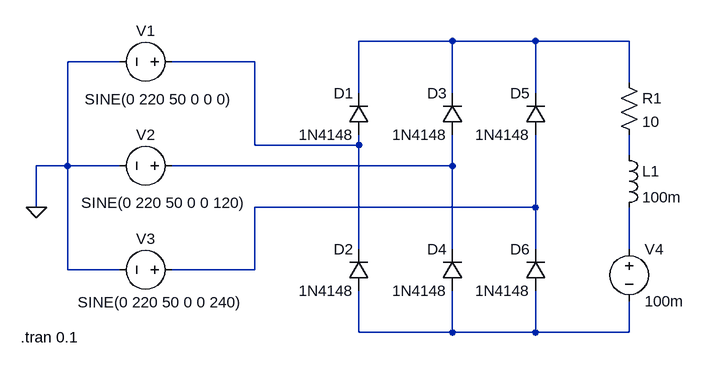
[diagram p0: schematic 3 Phase FWR-RLE.asc]
3 Phase FWR-RLE.asc, the LTspice schematic file:
Version 4
SHEET 1 880 680
WIRE 464 -208 320 -208
WIRE 592 -208 464 -208
WIRE 736 -208 592 -208
WIRE -48 -176 -128 -176
WIRE 160 -176 32 -176
WIRE 736 -144 736 -208
WIRE 320 -128 320 -208
WIRE 464 -128 464 -208
WIRE 592 -128 592 -208
WIRE 160 -48 160 -176
WIRE 320 -48 320 -64
WIRE 320 -48 160 -48
WIRE 736 -32 736 -64
WIRE -128 -16 -128 -176
WIRE -128 -16 -176 -16
WIRE -48 -16 -128 -16
WIRE 464 -16 464 -64
WIRE 464 -16 32 -16
WIRE -176 48 -176 -16
WIRE 592 48 592 -64
WIRE 592 48 160 48
WIRE 320 112 320 -48
WIRE 464 112 464 -16
WIRE 592 112 592 48
WIRE 736 112 736 48
WIRE -128 144 -128 -16
WIRE -48 144 -128 144
WIRE 160 144 160 48
WIRE 160 144 32 144
WIRE 320 240 320 176
WIRE 464 240 464 176
WIRE 464 240 320 240
WIRE 592 240 592 176
WIRE 592 240 464 240
WIRE 736 240 736 192
WIRE 736 240 592 240
FLAG -176 48 0
SYMBOL voltage 48 -176 R90
WINDOW 0 -32 56 VBottom 2
WINDOW 3 42 36 VTop 2
WINDOW 123 0 0 Left 0
WINDOW 39 0 0 Left 0
SYMATTR InstName V1
SYMATTR Value SINE(0 220 50 0 0 0)
SYMBOL voltage 48 -16 R90
WINDOW 0 -32 56 VBottom 2
WINDOW 3 41 28 VTop 2
WINDOW 123 0 0 Left 0
WINDOW 39 0 0 Left 0
SYMATTR InstName V2
SYMATTR Value SINE(0 220 50 0 0 120)
SYMBOL voltage 48 144 R90
WINDOW 0 -32 56 VBottom 2
WINDOW 3 34 33 VTop 2
WINDOW 123 0 0 Left 0
WINDOW 39 0 0 Left 0
SYMATTR InstName V3
SYMATTR Value SINE(0 220 50 0 0 240)
SYMBOL diode 336 -64 R180
WINDOW 0 24 64 Left 2
WINDOW 3 24 0 Left 2
SYMATTR InstName D1
SYMATTR Value 1N4148
SYMBOL diode 336 176 R180
WINDOW 0 24 64 Left 2
WINDOW 3 24 0 Left 2
SYMATTR InstName D2
SYMATTR Value 1N4148
SYMBOL diode 480 -64 R180
WINDOW 0 24 64 Left 2
WINDOW 3 24 0 Left 2
SYMATTR InstName D3
SYMATTR Value 1N4148
SYMBOL diode 480 176 R180
WINDOW 0 24 64 Left 2
WINDOW 3 24 0 Left 2
SYMATTR InstName D4
SYMATTR Value 1N4148
SYMBOL diode 608 -64 R180
WINDOW 0 24 64 Left 2
WINDOW 3 24 0 Left 2
SYMATTR InstName D5
SYMATTR Value 1N4148
SYMBOL diode 608 176 R180
WINDOW 0 24 64 Left 2
WINDOW 3 24 0 Left 2
SYMATTR InstName D6
SYMATTR Value 1N4148
SYMBOL res 720 -160 R0
SYMATTR InstName R1
SYMATTR Value 10
SYMBOL ind 720 -48 R0
SYMATTR InstName L1
SYMATTR Value 100m
SYMBOL voltage 736 96 R0
WINDOW 123 0 0 Left 0
WINDOW 39 0 0 Left 0
SYMATTR InstName V4
SYMATTR Value 100m
TEXT -200 248 Left 2 !.tran 0.1

The netlist it stands for:
* 3 Phase FWR-RLE.asc
V1 N002 0 SINE(0 220 50 0 0 0)
V2 N004 0 SINE(0 220 50 0 0 120)
V3 N005 0 SINE(0 220 50 0 0 240)
D1 N002 N001 1N4148
D2 N007 N002 1N4148
D3 N004 N001 1N4148
D4 N007 N004 1N4148
D5 N005 N001 1N4148
D6 N007 N005 1N4148
R1 N001 N003 10
L1 N003 N006 100m
V4 N006 N007 100m
.model D D
.lib standard.dio
.tran 0.1
.backanno
.end